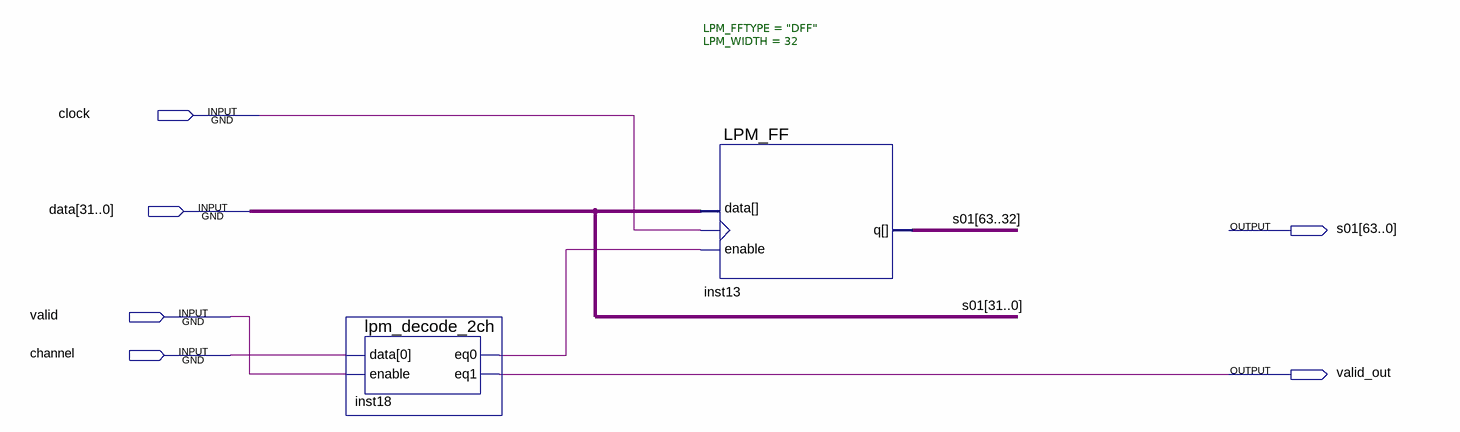
[diagram p0: schematic sheet]
// Quartus schematic avalon_to_64bit.bdf as structural Verilog: 2 symbols, 6 pins
module avalon_to_64bit (
  input  clock,
  input  [31:0] data,
  input  valid,
  input  channel,
  output [63:0] s01,
  output valid_out
);

  wire inst18_eq0;

  lpm_decode_2ch inst18 (.data(channel), .enable(valid), .eq0(inst18_eq0), .eq1(valid_out));
  LPM_FF #(.LPM_FFTYPE("DFF"), .LPM_WIDTH(32)) inst13 (.enable(inst18_eq0), .clock(clock), .data(data), .q(s01[63:32]));

  assign s01[31:0] = data;
endmodule
